# EAGLE design front_light (EAGLE 6.5.0)

## Sheet 1 of 2
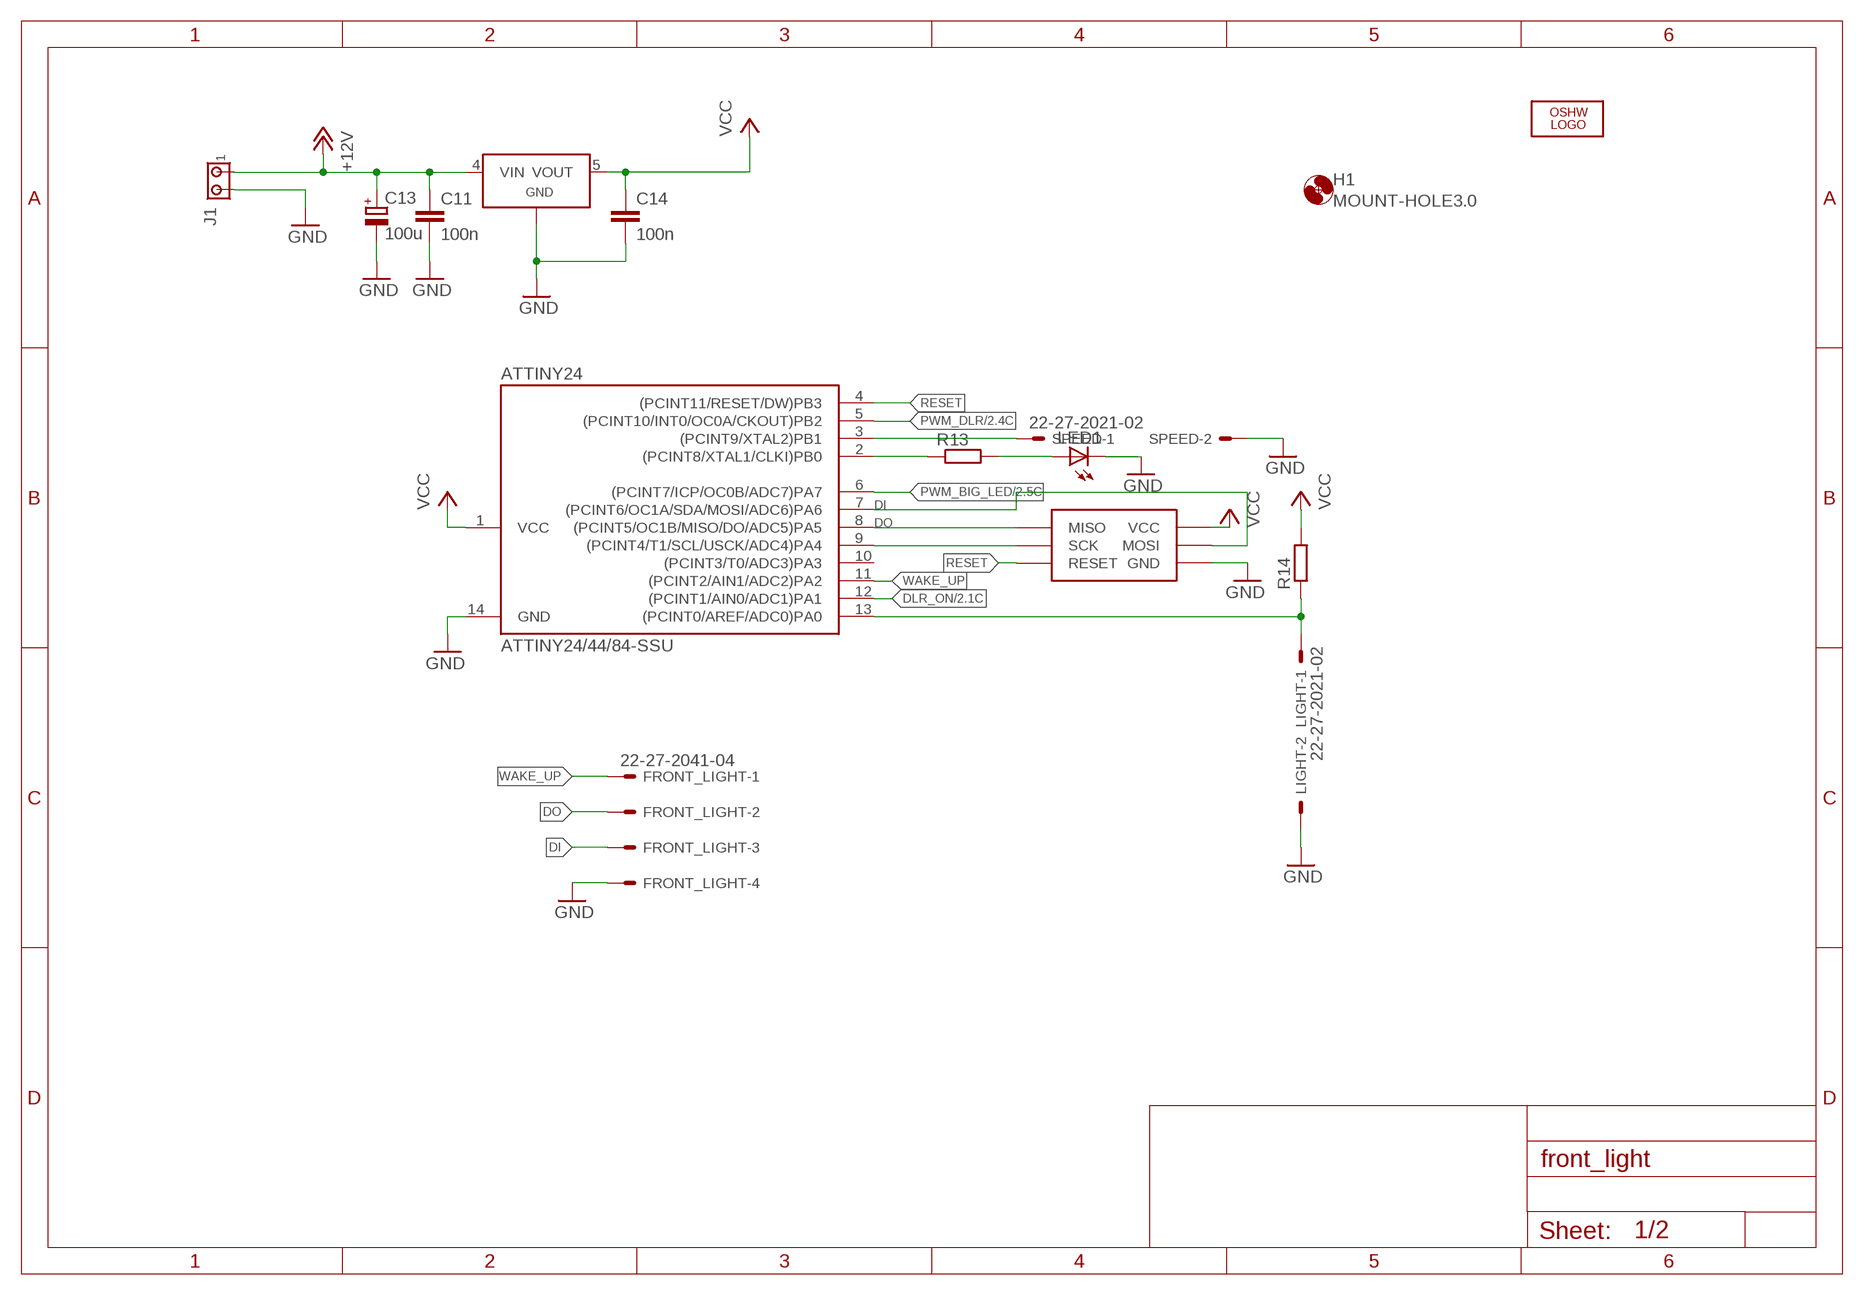
[diagram p0: schematic, sheet 1]

### Parts
ATTINY24  ATTINY24/44/84-SSU  [SOIC14]
C11  100n  C-EUC0603  [C0603]
C13  100u  CPOL-EUE  [PANASONIC_E]
C14  100n  C-EUC0603  [C0603]
FRONT_LIGHT  22-27-2041-04  [6410-04]
H1  MOUNT-HOLE3.0  [3,0]
J1  MTA02-156  [1X2MTA]
LED1  LEDCHIPLED_0603  [CHIPLED_0603]
LIGHT  22-27-2021-02  [6410-02]
LOGO2  OSHW_LOGO_6MILX0150-NT  [OSHW_6X150_NOTEXT]
R13  R-EU_R0603  [R0603]
R14  R-EU_R0603  [R0603]
SPEED  22-27-2021-02  [6410-02]
U$1  TPS71530  [SOT23-DBV]
U$2  ISP_SPECIALS  [ISP_RM2_00_STRAIGHT]

### Nets
+12V: C11.1 C13.+ J1.1 U$1.4(VIN) ; also sheet 2
DI: ATTINY24.7((PCINT6/OC1A/SDA/MOSI/ADC6)PA6) FRONT_LIGHT.3 U$2.MOSI
DLR_ON: ATTINY24.12((PCINT1/AIN0/ADC1)PA1) ; also sheet 2
DO: ATTINY24.8((PCINT5/OC1B/MISO/DO/ADC5)PA5) FRONT_LIGHT.2 U$2.RESET(MISO)
GND: ATTINY24.14(GND) C11.2 C13.- C14.2 FRONT_LIGHT.4 J1.2 LED1.C LIGHT.2 SPEED.2 U$1.2(GND) U$2.VCC(GND) ; also sheet 2
N$12: ATTINY24.3((PCINT9/XTAL2)PB1) SPEED.1
N$23: ATTINY24.9((PCINT4/T1/SCL/USCK/ADC4)PA4) U$2.SCK
N$24: ATTINY24.13((PCINT0/AREF/ADC0)PA0) LIGHT.1 R14.1
N$25: ATTINY24.2((PCINT8/XTAL1/CLKI)PB0) R13.1
N$26: LED1.A R13.2
PWM_BIG_LED: ATTINY24.6((PCINT7/ICP/OC0B/ADC7)PA7) ; also sheet 2
PWM_DLR: ATTINY24.5((PCINT10/INT0/OC0A/CKOUT)PB2) ; also sheet 2
RESET: ATTINY24.4((PCINT11/RESET/DW)PB3) U$2.MISO(RESET)
VCC: ATTINY24.1(VCC) C14.1 R14.2 U$1.5(VOUT) U$2.GND(VCC)
WAKE_UP: ATTINY24.11((PCINT2/AIN1/ADC2)PA2) FRONT_LIGHT.1
Unconnected: ATTINY24.10((PCINT3/T0/ADC3)PA3)

## Sheet 2 of 2
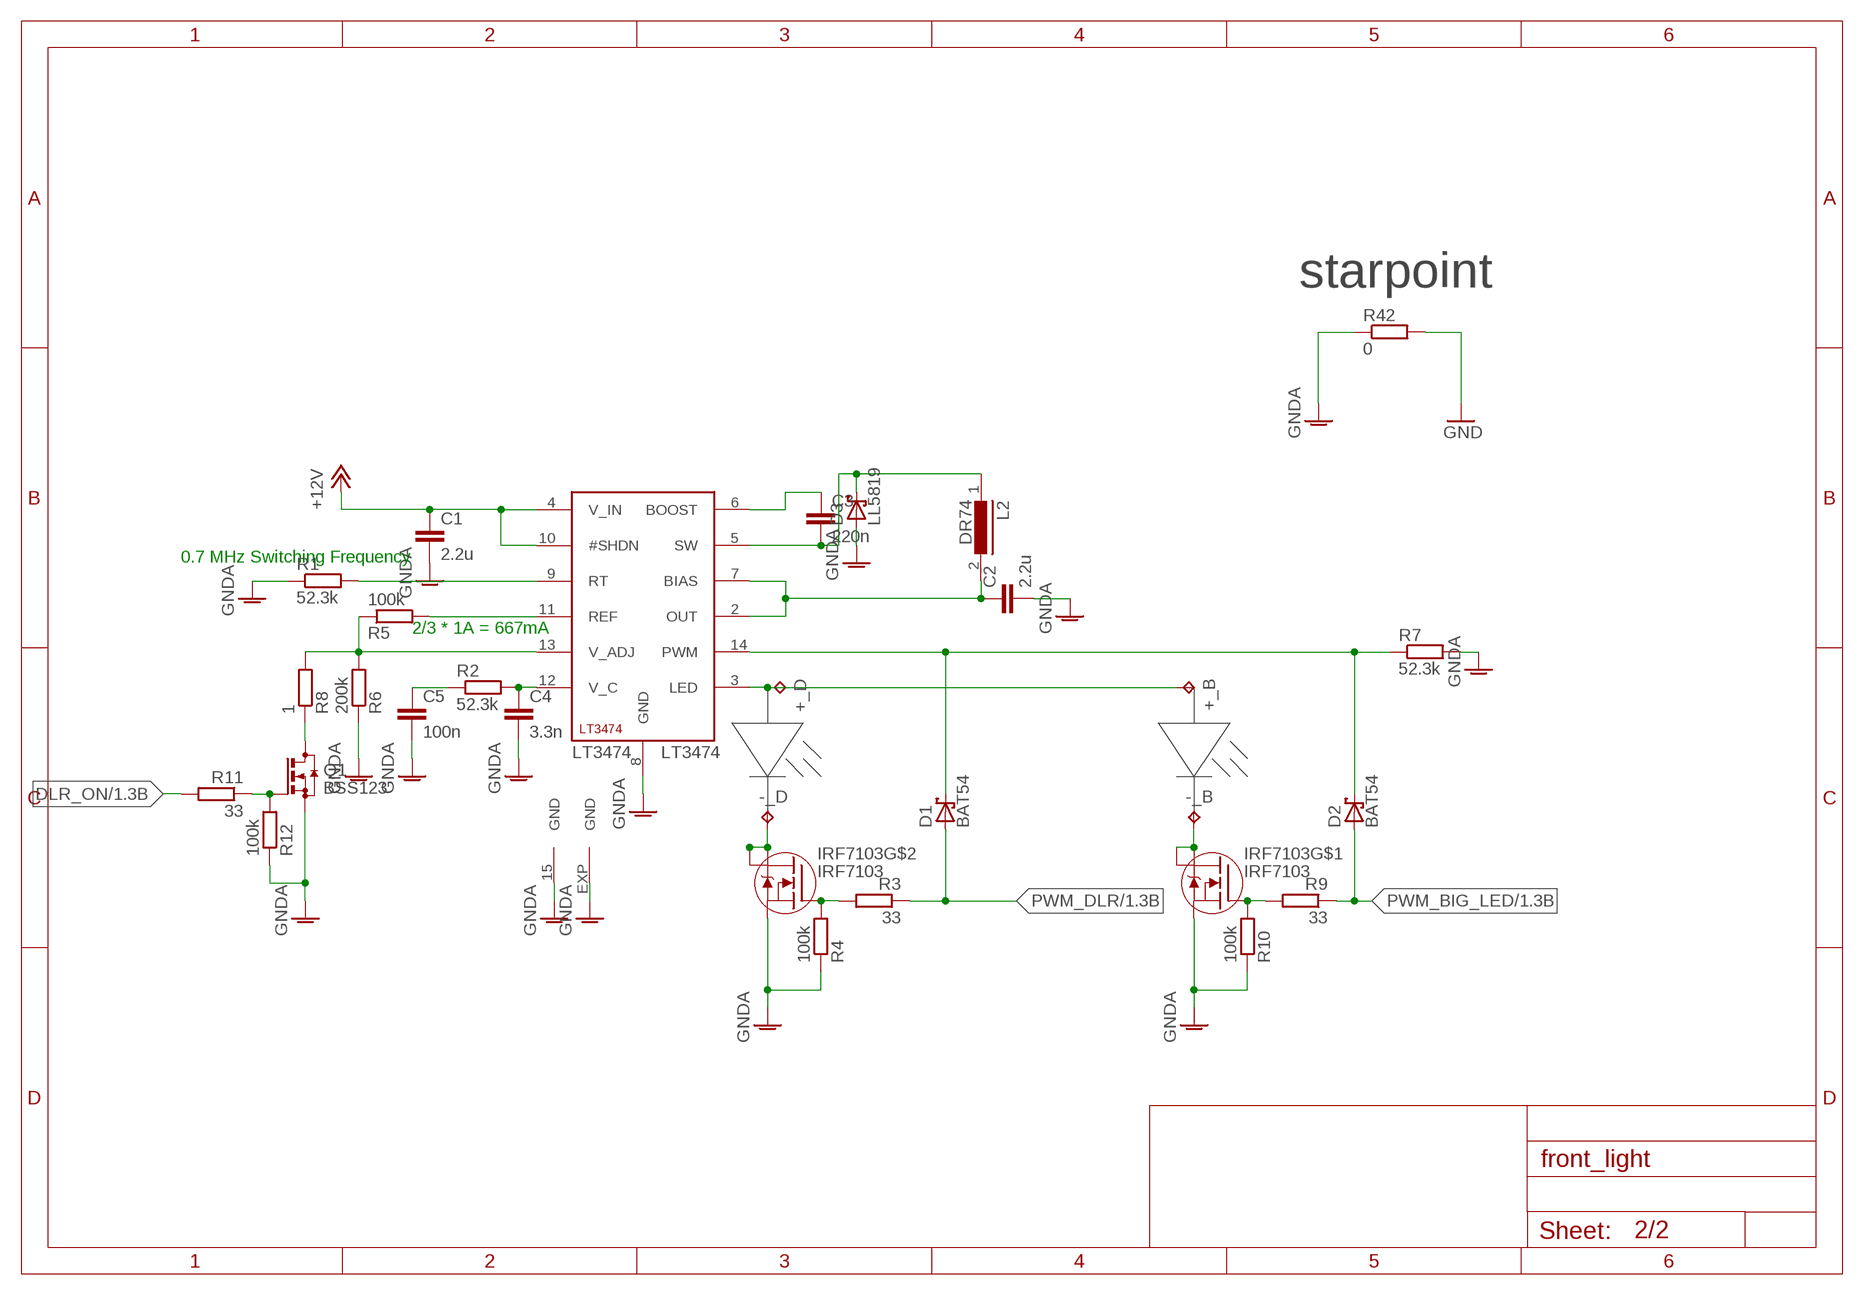
[diagram p1: schematic, sheet 2]

### Parts
+_B  TPTP20SQ  [TP20SQ]
+_D  TPTP20SQ  [TP20SQ]
-_B  TPTP20SQ  [TP20SQ]
-_D  TPTP20SQ  [TP20SQ]
C1  2.2u  C-EUC0805  [C0805]
C2  2.2u  C-EUC0805  [C0805]
C3  220n  C-EUC0603  [C0603]
C4  3.3n  C-EUC0603  [C0603]
C5  100n  C-EUC0603  [C0603]
D1  BAT54  [SOT23]
D2  BAT54  [SOT23]
D3  LL5819  DIODESCHOTTKY  [MELF-MLL41]
IRF7103  IRF7103  [SO8-2]
L2  DR74  [DR74]
LT3474  LT3474  [TSSOP16_BA]
Q1  BSS123  [SOT23]
R1  52.3k  R-EU_R0603  [R0603]
R2  52.3k  R-EU_R0603  [R0603]
R3  33  R-EU_R0603  [R0603]
R4  100k  R-EU_R0603  [R0603]
R5  100k  R-EU_R0603  [R0603]
R6  200k  R-EU_R0603  [R0603]
R7  52.3k  R-EU_R0603  [R0603]
R8  1  R-EU_R0603  [R0603]
R9  33  R-EU_R0603  [R0603]
R10  100k  R-EU_R0603  [R0603]
R11  33  R-EU_R0603  [R0603]
R12  100k  R-EU_R0603  [R0603]
R42  0  R-EU_R0603  [R0603]

### Nets
+12V: C1.1 LT3474.4(V_IN) LT3474.10(#SHDN) ; also sheet 1
DLR_ON: R11.2 ; also sheet 1
GND: R42.2 ; also sheet 1
GNDA: C1.2 C2.2 C4.2 C5.2 D3.A IRF7103.1(S) IRF7103.3(S) LT3474.8(GND) LT3474.15(GND) LT3474.EXP(GND) Q1.2(S) R1.1 R4.1 R6.1 R7.2 R10.1 R12.1 R42.1
N$1: C3.2 D3.C L2.1 LT3474.5(SW)
N$2: C2.1 L2.2 LT3474.2(OUT) LT3474.7(BIAS)
N$3: LT3474.11(REF) R5.2
N$4: LT3474.9(RT) R1.2
N$5: C3.1 LT3474.6(BOOST)
N$6: C4.1 LT3474.12(V_C) R2.2
N$7: C5.1 R2.1
N$8: +_B.TP +_D.TP LT3474.3(LED)
N$9: -_D.TP IRF7103.5(D) IRF7103.6(D)
N$10: IRF7103.4(G) R3.2 R4.2
N$11: LT3474.13(V_ADJ) R5.1 R6.2 R8.2
N$13: Q1.3(D) R8.1
N$15: Q1.1(G) R11.1 R12.2
N$20: -_B.TP IRF7103.7(D) IRF7103.8(D)
N$21: IRF7103.2(G) R9.2 R10.2
PWM: D1.3(C) D2.3(C) LT3474.14(PWM) R7.1
PWM_BIG_LED: D2.1(A) R9.1 ; also sheet 1
PWM_DLR: D1.1(A) R3.1 ; also sheet 1
Unconnected: LT3474.1(DNC1) LT3474.16(DNC2)

### Notes on the sheet
- starpoint
- 0.7 MHz Switching Frequency
- 2/3 * 1A = 667mA

## Library data of the parts
+_B +_D -_B -_D = testpad:TP: Test pad
ATTINY24 = attiny24_44_84:ATTINY24/44/84
C1-C5 C11 C14 = resistor:C-EU: CAPACITOR, European symbol
C13 = resistor:CPOL-EU: POLARIZED CAPACITOR, European symbol
D1 D2 = diode:BAT54: Schottky Diodes Source: Fairchild .. BAT54.pdf
D3 = Brunner:DIODESCHOTTKY
FRONT_LIGHT = con-molex:22-?-04: CONNECTOR wire to board 2.54 mm (.1 inch) pitch header; OC_FARNELL: unknown; OC_NEWARK: unknown
H1 = holes:MOUNT-HOLE: MOUNTING HOLE with drill center marker
IRF7103 = irf-2:IRF7103: HEXFET® Power MOSFET Adavanced Process Technology Ultra Low On-Resistance Dual N-Channel MOSFET Surface Mount Available in Tape & Reel Dynamic dv/dt Rating Fast Switching Please connect both Drain-Pins of each FET for thermal Reasons! (Pin 5 with Pin 6, 7 with 8)
J1 = con-amp:MTA02-156: AMP connector; OC_FARNELL: unknown; OC_NEWARK: unknown
L2 = inductors:DR74: High Power Density, High Efficiency, Shielded Inductors Source: coiltronics_dr_series.pdf
LED1 = led:LED: LED OSRAM: - CHIPLED LG R971, LG N971, LY N971, LG Q971, LY Q971, LO R971, LY R971 LH N974, LH R974 LS Q976, LO Q976, LY Q976 LO Q996 - Hyper CHIPLED LW Q18S LB Q993, LB Q99A, LB R99A - SideLED LS A670, LO A670, LY A670, LG A670, LP A670 LB A673, LV A673, LT A673, LW A673 LH A674 LY A675 LS A676, LA A676, LO A676, LY A676, LW A676 LS A679, LY A679, LG A679 - Hyper Micro SIDELED® LS Y876, LA Y876, LO Y876, LY Y876 LT Y87S - SmartLED LW L88C, LW L88S LB L89C, LB L89S, LG L890 LS L89K, LO L89K, LY L89K LS L896, LA L896, LO L896, LY L896 - TOPLED LS T670, LO T670, LY T670, LG T670, LP T670 LSG T670, LSP T670, LSY T670, LOP T670, LYG T670 LG T671, LOG T671, LSG T671 LB T673, LV T673, LT T673, LW T673 LH T674 LS T676, LA T676, LO T676, LY T676, LB T676, LH T676, LSB T676, LW T676 LB T67C, LV T67C, LT T67C, LS T67K, LO T67K, LY T67K, LW E67C LS E67B, LA E67B, LO E67B, LY E67B, LB E67C, LV E67C, LT E67C LW T67C LS T679, LY T679, LG T679 LS T770, LO T770, LY T770, LG T770, LP T770 LB T773, LV T773, LT T773, LW T773 LH T774 LS E675, LA E675, LY E675, LS T675 LS T776, LA T776, LO T776, LY T776, LB T776 LHGB T686 LT T68C, LB T68C - Hyper Mini TOPLED® LB M676 - Mini TOPLED Santana® LG M470 LS M47K, LO M47K, LY M47K Source: http://www.osram.convergy.de LUXEON: - LUMILED® LXK2-PW12-R00, LXK2-PW12-S00, LXK2-PW14-U00, LXK2-PW14-V00 LXK2-PM12-R00, LXK2-PM12-S00, LXK2-PM14-U00 LXK2-PE12-Q00, LXK2-PE12-R00, LXK2-PE12-S00, LXK2-PE14-T00, LXK2-PE14-U00 LXK2-PB12-K00, LXK2-PB12-L00, LXK2-PB12-M00, LXK2-PB14-N00, LXK2-PB14-P00, LXK2-PB14-Q00 LXK2-PR12-L00, LXK2-PR12-M00, LXK2-PR14-Q00, LXK2-PR14-R00 LXK2-PD12-Q00, LXK2-PD12-R00, LXK2-PD12-S00 LXK2-PH12-R00, LXK2-PH12-S00 LXK2-PL12-P00, LXK2-PL12-Q00, LXK2-PL12-R00 Source: www.luxeon.com KINGBRIGHT: KA-3528ASYC Source: www.kingbright.com
LIGHT SPEED = con-molex:22-?-02: CONNECTOR wire to board 2.54 mm (.1 inch) pitch header; OC_FARNELL: unknown; OC_NEWARK: unknown
LOGO2 = ea:OSHW_LOGO_6MIL
LT3474 = ltc_swr:LT3474: LT3474 - Step-Down 1A LED Driver True Color PWM Delivers Constant Color with 400:1 Dimming Range Wide Input Range: 4V to 36V Up to 1A LED Current Adjustable 200kHz–2MHz Switching Frequency Adjustable Control of LED Current Integrated Boost Diode High Output Current Accuracy is Maintained Over a Wide Range from 35mA to 1A Open LED and Short-Circuit Protection High Side Sense Allows Grounded Cathode Connection Uses Small Inductors and Ceramic Capacitors Compact 16-Lead TSSOP Thermally Enhanced Surface Mount Package
Q1 = transistor-small-signal:BSS123: N-CHANNEL MOS FET
R1-R14 = resistor:R-EU_: RESISTOR, European symbol
R42 = rcl:R-EU_: RESISTOR, European symbol
U$1 = ShortCircuitRobotics:TPS71530
U$2 = bookla:ISP_SPECIAL

## Board
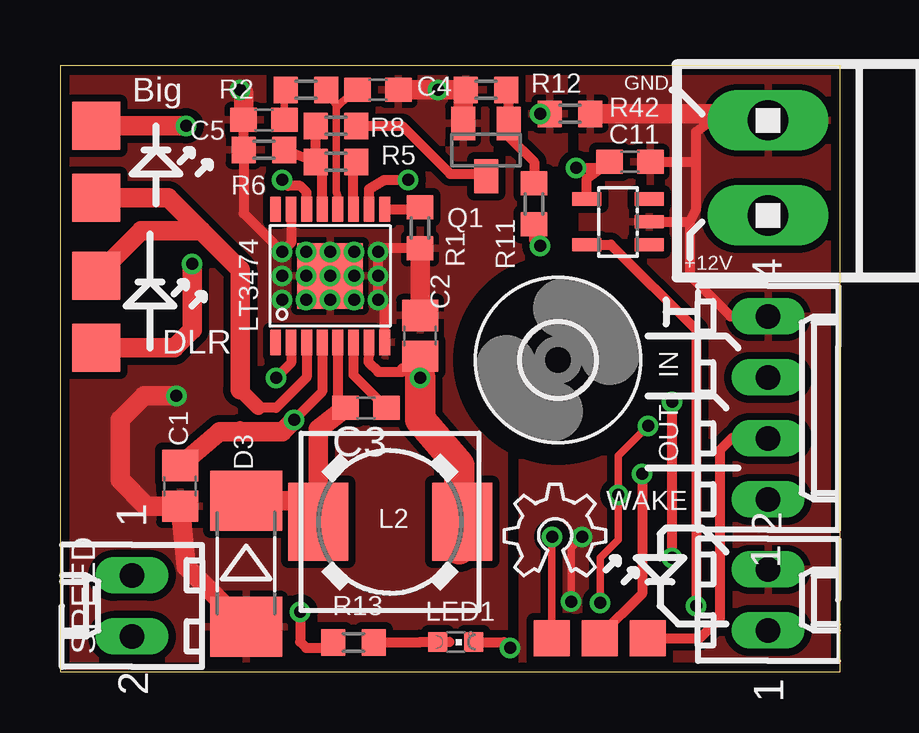
[diagram p2: board, top side]
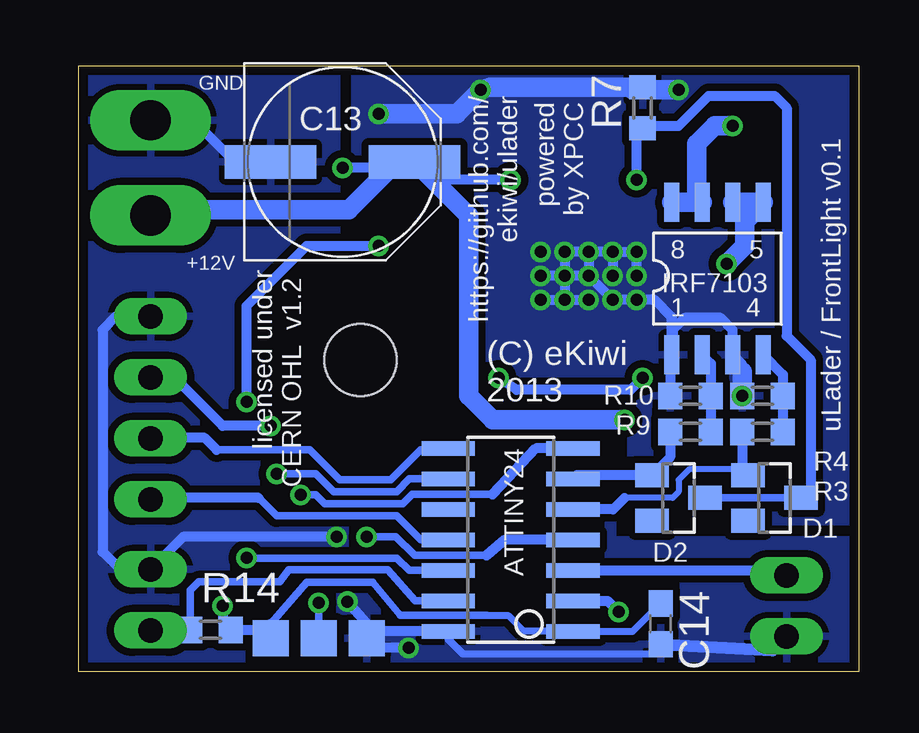
[diagram p3: board, bottom side, seen from below]

Size 32.5 x 25.25 mm. Coordinates in mm from the lower left corner, seen from the top.
Outline: 0,0 32.5,0 32.5,25.25 0,25.25 0,0
Copper layers (1*16): Top 0.0356mm / dielectric 1.5011mm / Bottom 0.0356mm
Design rules "LaenPCBOrder *": minimum track width 6mil, minimum drill 13mil, track to track 6mil, track to pad 6mil, pad to pad 6mil, via to via 6mil, smd to smd 0mil, copper to edge 15mil, drill to drill 6mil, minimum pad ring 7mil, minimum via ring 7mil, stop-mask expansion 3mil, vias tented up to drill 24mil, thermal gap 10mil

### Footprints (pad centres in the part's own frame; a part is rotated, then mirrored left to right if it is on the bottom)
TP20SQ = smd 2 x 2: TP 0,0
SOIC14 = smd 0.61 x 2.21: 1 -3.81,-2.603; 2 -2.54,-2.603; 3 -1.27,-2.603; 4 0,-2.603; 5 1.27,-2.603; 6 2.54,-2.603; 7 3.81,-2.603; 8 3.81,2.603; 9 2.54,2.603; 10 1.27,2.603; 11 0,2.603; 12 -1.27,2.603; 13 -2.54,2.603; 14 -3.81,2.603
C0805 = smd 1.3 x 1.5: 1 -0.85,0; 2 0.85,0
C0603 = smd 1.1 x 1: 1 -0.85,0; 2 0.85,0
PANASONIC_E = smd 3.8 x 1.4: + 3,0; - -3,0
SOT23 = smd 1 x 1.4: 1 -0.95,-1.1; 2 0.95,-1.1; 3 0,1.1
MELF-MLL41 = smd 2.5 x 3: A 2.625,0; C -2.625,0
6410-04 = drill 1.016 long: 1 3.81,0; 2 1.27,0; 3 -1.27,0; 4 -3.81,0
3,0 = hole 3: 0,0
SO8-2 = smd 0.61 x 1.626: 1 -2.54,-2.54; 2 -1.27,-2.54; 3 0,-2.54; 4 1.27,-2.54; 5 1.27,3.81; 6 0,3.81; 7 -1.27,3.81; 8 -2.54,3.81
1X2MTA = drill 1.676 long: 1 1.981,0; 2 -1.981,0
DR74 = smd 2.5 x 3.25: 1 -3,0; 2 3,0
CHIPLED_0603 = smd 0.8 x 0.8: A 0,-0.75; C 0,0.75
6410-02 = drill 1.016 long: 1 1.27,0; 2 -1.27,0
TSSOP16_BA = smd 0.45 x 1.05: 1 -2.275,-2.775; 2 -1.625,-2.775; 3 -0.975,-2.775; 4 -0.325,-2.775; 5 0.325,-2.775; 6 0.975,-2.775; 7 1.625,-2.775; 8 2.275,-2.775; 9 2.275,2.775; 10 1.625,2.775; 11 0.975,2.775; 12 0.325,2.775; 13 -0.325,2.775; 14 -0.975,2.775; 15 -1.625,2.775; 16 -2.275,2.775 | smd 2.74 x 2.74: EXP 0,0
R0603 = smd 1 x 1.1: 1 -0.85,0; 2 0.85,0
SOT23-DBV = smd 0.55 x 1.2: 1 -0.95,-1.3; 2 0,-1.3; 3 0.95,-1.3; 4 0.95,1.3; 5 -0.95,1.3
ISP_RM2_00_STRAIGHT = smd 1.5 x 1.5 bottom: GND 2,-0.85; MOSI 0,-0.85; VCC -2,-0.85 | smd 1.5 x 1.5: MISO -2,-0.85; RESET 2,-0.85; SCK 0,-0.85

### Placement (x,y rotation side)
+_B  1.5,19.75 0 top
+_D  1.5,16.5 0 top
-_B  1.5,22.75 0 top
-_D  1.5,13.5 0 top
ATTINY24  14.5,5.5 90 bottom
C1  5,7.75 270 top
C2  15,14 90 top
C3  12.75,11 180 top
C4  13.25,24.25 0 top
C5  8.5,23 180 top
C11  23.75,21.25 0 top
C13  21.5,21.25 0 bottom
C14  8.25,2 270 bottom
D1  3.5,7.25 270 bottom
D2  7.5,7.25 270 bottom
D3  7.75,4.5 270 top
FRONT_LIGHT  29.5,11 270 top
H1  20.75,13 0 top
IRF7103  5.24,15.75 0 bottom
J1  29.5,21 270 top
L2  13.75,6.25 0 top
LED1  16.49,1.25 270 top
LIGHT  29.5,3 270 top
LOGO2  18.5,4 0 top
LT3474  11.25,16.5 0 top
Q1  17.75,21.75 180 top
R1  15,18.5 90 top
R2  10.25,24.25 0 top
R3  4,10 0 bottom
R4  4,11.5 0 bottom
R5  11.5,21.25 0 top
R6  8.5,21.75 0 top
R7  9,23.5 90 bottom
R8  11.5,22.75 180 top
R9  7,10 0 bottom
R10  7,11.5 0 bottom
R11  19.75,19.5 270 top
R12  17.75,24.25 0 top
R13  12.23,1.23 0 top
R14  27,1.75 0 bottom
R42  21.25,23.25 0 top
SPEED  3,2.75 90 top
U$1  23.25,18.75 90 top
U$2  22.5,2.25 0 top

### Tracks (layer width: path | path; a pad name or v marks a point on that pad's centre or on a via)
+12V  (via drill 0.5)
  Top 0.406: LT3474.10 12.88,20.12 13.5,20.5 v14.5,20.5 | LT3474.4 10.93,11.68 v9.75,10.5 | 7.5,10.25 7.75,10 | U$1.4 21.95,20.55 C11.1 22.9,21 v21.5,21
  Top 0.813: v9.75,10.5 9.25,10 7.75,10 6.65,10 C1.1
  Bottom 0.406: v14.5,20.5 17.75,20.5 C13.+ | 21.25,19.25 21.25,19.5 19.75,21 v21.5,21
  Bottom 0.813: v9.75,10.5 15.25,10.5 16.25,11.5 16.25,19 C13.+ 19.25,21.25 21.25,19.25 29.48,19.25 J1.1
DI  (via drill 0.5)
  Top 0.305: v22.5,2.88 22.5,4.75 23.25,5.5 v23.25,7.38 23.25,9 v24.5,10.25
  Bottom 0.305: 22.5,1.75 v22.5,2.88 | 15.25,7.4 18.6,7.4 19,7 22.25,7 22.62,7.38 v23.25,7.38
  Bottom 0.406: FRONT_LIGHT.3 28.52,12.27 26.5,10.25 v24.5,10.25 | ATTINY24.7 13.44,9.31 15.25,7.4 | U$2.MOSI 22.5,1.75
DLR_ON  (via drill 0.5)
  Top 0.406: v25.5,4.75 v25.5,11.25 | v20,17.75 19.75,18 R11.2
  Bottom 0.305: ATTINY24.12 18.73,4.23 19.25,4.72 25.48,4.72 v25.5,4.75
  Bottom 0.406: v25.5,11.25 25.5,15.25 23,17.75 v20,17.75
DO
  Top 0.406: U$2.RESET 26.65,1.4 27.5,2.25 27.5,9.25 28,9.75 29.98,9.75 FRONT_LIGHT.2
  Bottom 0.305: ATTINY24.8 18,9.25 18.25,9.25 19.5,8 21.62,8 22.88,9.25 26.75,9.25
  Bottom 0.406: 26.75,9.25 27.25,9.75 29.23,9.75 FRONT_LIGHT.2
GND  (via drill 0.5)
  Top 0.305: v21.3,2.92 21.3,5.17 v21.75,5.62
  Top 0.406: U$1.2 26.25,18.75 | 26.25,18.75 26.5,19.25 26.5,21.25 | 26.5,21.25 26.5,22.5 27.5,23.25 | FRONT_LIGHT.4 27.94,14.81 26.25,16.5 26.25,18.75 | C11.2 26.5,21.25 | LED1.C 18.5,1.25 v18.75,1
  Top 0.813: R42.2 27.5,23.25 29.48,23.25 J1.2
  Bottom 0.3: 16.5,0.75 8.4,0.75 C14.2
  Bottom 0.305: ATTINY24.14 17.1,1.35 16.5,0.75
  Bottom 0.406: 29.98,4.25 LIGHT.2 | ATTINY24.14 20.21,1.69 U$2.VCC | v18.75,1 20.1,1 U$2.VCC | FRONT_LIGHT.4 30.94,14.81 31.5,14.25 31.5,5 30.75,4.25 30.02,4.25 LIGHT.2 | C13.- 26,21.25 28,23.25 29.73,23.25 J1.2 | U$2.VCC 20.5,2 v21.3,2.92 | v21.75,5.62 28.14,5.62 LIGHT.2
  Bottom 0.5: C14.2 3.58,0.9 SPEED.2
  pour Top (isolate 0.305): 21.75,16.5 21.75,25.25 32.5,25.25 32.5,0 19.25,0 19.25,9.25 22,9.25 24.5,11.75 24.5,14.5 22.5,16.5
  pour Bottom (isolate 0.305): 21.75,25.25 21.75,9.75 10.25,9.75 10.25,5.5 7.25,5.5 0,5.5 0,0 32.5,0 32.5,25.25
GNDA  (via drill 0.5)
  Top 0.406: Q1.2 16.8,24.4 R12.1 | LT3474.8 13.53,15.22 v13.25,15.5 v13.25,17.5 13.4,17.65 R1.1 | LT3474.15 9.62,17.88 v9.25,17.5 7.65,19.1 R6.1 C5.2
  Top 0.813: D3.A 5.25,4.38 C1.2 3.6,6.9 2.5,8 2.5,10.5 3.5,11.5 R4.1 | C2.2 R1.1 | v20,23.25 R42.1 | C5.2 7.65,24.1 v7.5,24.25 | C4.2 v15.75,24.25 16.75,24.25 | 16.75,24.25 R12.1 | Q1.2 16.8,24.2 16.75,24.25
  Bottom 0.305: 7.75,13.24 IRF7103.1
  Bottom 0.406: 4.85,12.5 4.85,12.82 IRF7103.3 5.24,14.24 5.75,14.75 7.25,14.75 7.75,14.25 7.75,13.24 | R10.1 7.85,13.14 IRF7103.1 7.78,14.78 8.5,15.5 v9.25,15.5 v10.25,15.5 LT3474.EXP | v9.25,16.5 v9.25,17.5 v10.25,17.5 | v10.25,17.5 v10.25,16.5 | v11.25,17.5 v12.25,17.5 v12.25,16.5 v12.25,15.5 | v12.25,15.5 v11.25,15.5 | LT3474.EXP v13.25,16.5 | v13.25,15.5 v12.25,15.5 | v10.25,17.5 v11.25,17.5 | v11.25,17.5 LT3474.EXP
  Bottom 0.813: R4.1 4.85,12.5 | R7.2 9.5,24.35 | 9.5,24.35 15.35,24.35 v15.75,24.25 16.75,23.25 v20,23.25 | v7.5,24.25 9.4,24.25 9.5,24.35
  other vias: 11.25,16.5 4.85,11.5
  pour Top (isolate 0.305): 0,25.25 21,25.25 21,17.25 20.75,16.5 19.5,16.5 17.25,14.25 17.25,11.25 18.5,10 18.5,0 0,0
  pour Bottom (isolate 0.305): 0,25.25 21,25.25 21,10.5 9.5,10.5 9.5,6.25 0,6.25
N$1
  Top 0.406: LT3474.5 11.57,11.32 C3.2
  Top 0.813: L2.1 10.75,7 | 10.75,7 10.75,10.1 C3.2 | D3.C 10.62,7.12 10.75,7
N$2  (via drill 0.5)
  Top 0.406: LT3474.7 12.85,12.9 13.25,12.5 14.25,12.5 14.25,12.65 C2.1 v15,12.25 | LT3474.2 9.62,12.88 v9,12.25
  Top 1.27: v15,12.25 15,10.5 16.64,8.61 16.64,5.11 16.5,6.25 L2.2
  Bottom 0.406: v9,12.25 9.5,11.75 14.25,11.75 v15,12.25
N$3
  Top 0.406: LT3474.11 12.22,20.88 R5.2
N$4
  Top 0.406: LT3474.9 14.93,19.27 R1.2
N$5
  Top 0.406: LT3474.6 12.22,12.38 C3.1
N$6
  Top 0.305: LT3474.12 11.57,19.82 11.5,20 11.5,23.5 | 11.5,23.5 11.5,23.6 R2.2 | 11.5,23.5 11.75,23.75 C4.1
N$7
  Top 0.305: C5.1 9.35,24.2 R2.1
N$8
  Top 0.406: 8.25,11 9,11 10.28,12.28 LT3474.3
  Top 0.61: 7.5,11.75 8.25,11
  Top 0.813: 7.5,11.75 7.5,16.75 5.88,18.38 | +_B.TP 4.5,19.75 5.88,18.38 | +_D.TP 3.38,18.38 5.88,18.38
N$9  (via drill 0.5)
  Top 0.813: -_D.TP 4.75,13.5 5.5,14.25 v5.5,17
  Bottom 0.813: v5.5,17 4.75,17.75 4.75,18.78 IRF7103.5 IRF7103.6
N$10
  Bottom 0.406: IRF7103.4 3.15,12.39 R4.2 R3.2
N$11
  Top 0.406: LT3474.13 10.93,20.98 R5.1 | R6.2 R5.1 | R5.1 R8.2
N$12
  Bottom 0.406: ATTINY24.3 3.21,4.23 SPEED.1
N$13
  Top 0.406: R8.1 14.25,22.75 16.25,20.75 17.6,20.75 Q1.3
N$15
  Top 0.406: R12.2 18.7,24.4 Q1.1 18.7,22.3 19.75,21.25 R11.1
N$20  (via drill 0.5)
  Top 0.813: -_B.TP v5.25,22.75
  Bottom 0.813: v5.25,22.75 6,22.75 6.75,22 6.75,19.8 IRF7103.7 IRF7103.8
N$21
  Bottom 0.406: IRF7103.2 6.15,12.85 R10.2 R9.2
N$23  (via drill 0.5)
  Top 0.406: v24.25,8.25 24.25,3.25 22.5,1.5 U$2.SCK
  Bottom 0.305: ATTINY24.9 18.71,8.04 19.25,7.5 21.88,7.5 22.62,8.25 v24.25,8.25
N$24
  Bottom 0.305: ATTINY24.13 18.46,2.96 19.62,4.25 23.75,4.25 24.12,3.75 27.5,3.75 27.85,3.4 R14.1
  Bottom 0.406: 29.98,1.75 LIGHT.1 27.87,1.73 R14.1
N$25  (via drill 0.5)
  Top 0.406: v10,2.5 10,1.25 10.25,1 11.15,1 R13.1
  Bottom 0.406: ATTINY24.2 10.46,2.96 v10,2.5
N$26
  Top 0.406: R13.2 14.98,1.23 15,1.25 16.23,1.25 LED1.A
PWM  (via drill 0.5)
  Top 0.406: LT3474.14 10.28,19.98 10,20.25 9.5,20.25 v9.25,20.5
  Bottom 0.305: D2.3 D1.3
  Bottom 0.406: 2,7.25 D1.3 2,7.65 2,13 3,14 3,23.5 3.5,24 6.25,24 7.5,22.75 9.25,22.75 v9.25,20.5 9.25,22.4 R7.1
PWM_BIG_LED
  Bottom 0.406: R9.1 7.85,8.95 D2.1 11.74,8.2 ATTINY24.6
PWM_DLR
  Bottom 0.254: 4.85,8.45 7.05,8.45 7.5,8 7.5,7.5 7.75,7.25 9.75,7.25
  Bottom 0.406: R3.1 4.85,8.45 D1.1 | 9.75,7.25 10.23,6.77 ATTINY24.5
RESET  (via drill 0.5)
  Top 0.305: U$2.MISO 20.5,5.6 v20.5,5.62
  Bottom 0.305: 15.5,4.85 18.5,4.85 19.27,5.62 v20.5,5.62
  Bottom 0.406: ATTINY24.4 14.75,5.5 15.5,4.85
VCC  (via drill 0.5)
  Top 0.406: U$1.5 22.95,17.8 26.5,14.25 v26.5,2.75
  Bottom 0.3: 15.5,2.35 14.6,2.35 13.94,1.69 ATTINY24.1 9.41,1.69 C14.1
  Bottom 0.305: 24.5,2 23,3.73 20.25,3.73 19.1,2.35 15.5,2.35
  Bottom 0.406: 24.5,2 U$2.GND 24.85,1.75 R14.2 26.5,2.1 v26.5,2.75
WAKE_UP
  Bottom 0.305: ATTINY24.11 18.25,5.5 19.25,6.5 24.25,6.5 25,7.25
  Bottom 0.406: 25,7.25 29.19,7.25 FRONT_LIGHT.1

### Text on the board
tNames: Big | GND | +12V | DLR | IN | OUT | WAKE
bNames: powered / by XPCC | https://github.com/ / ekiwi/ulader | GND | licensed under / CERN OHL v1.2 | +12V | (C) eKiwi / 2013 | uLader / FrontLight v0.1